# EAGLE schematic OpenSpindle (EAGLE 6.3)
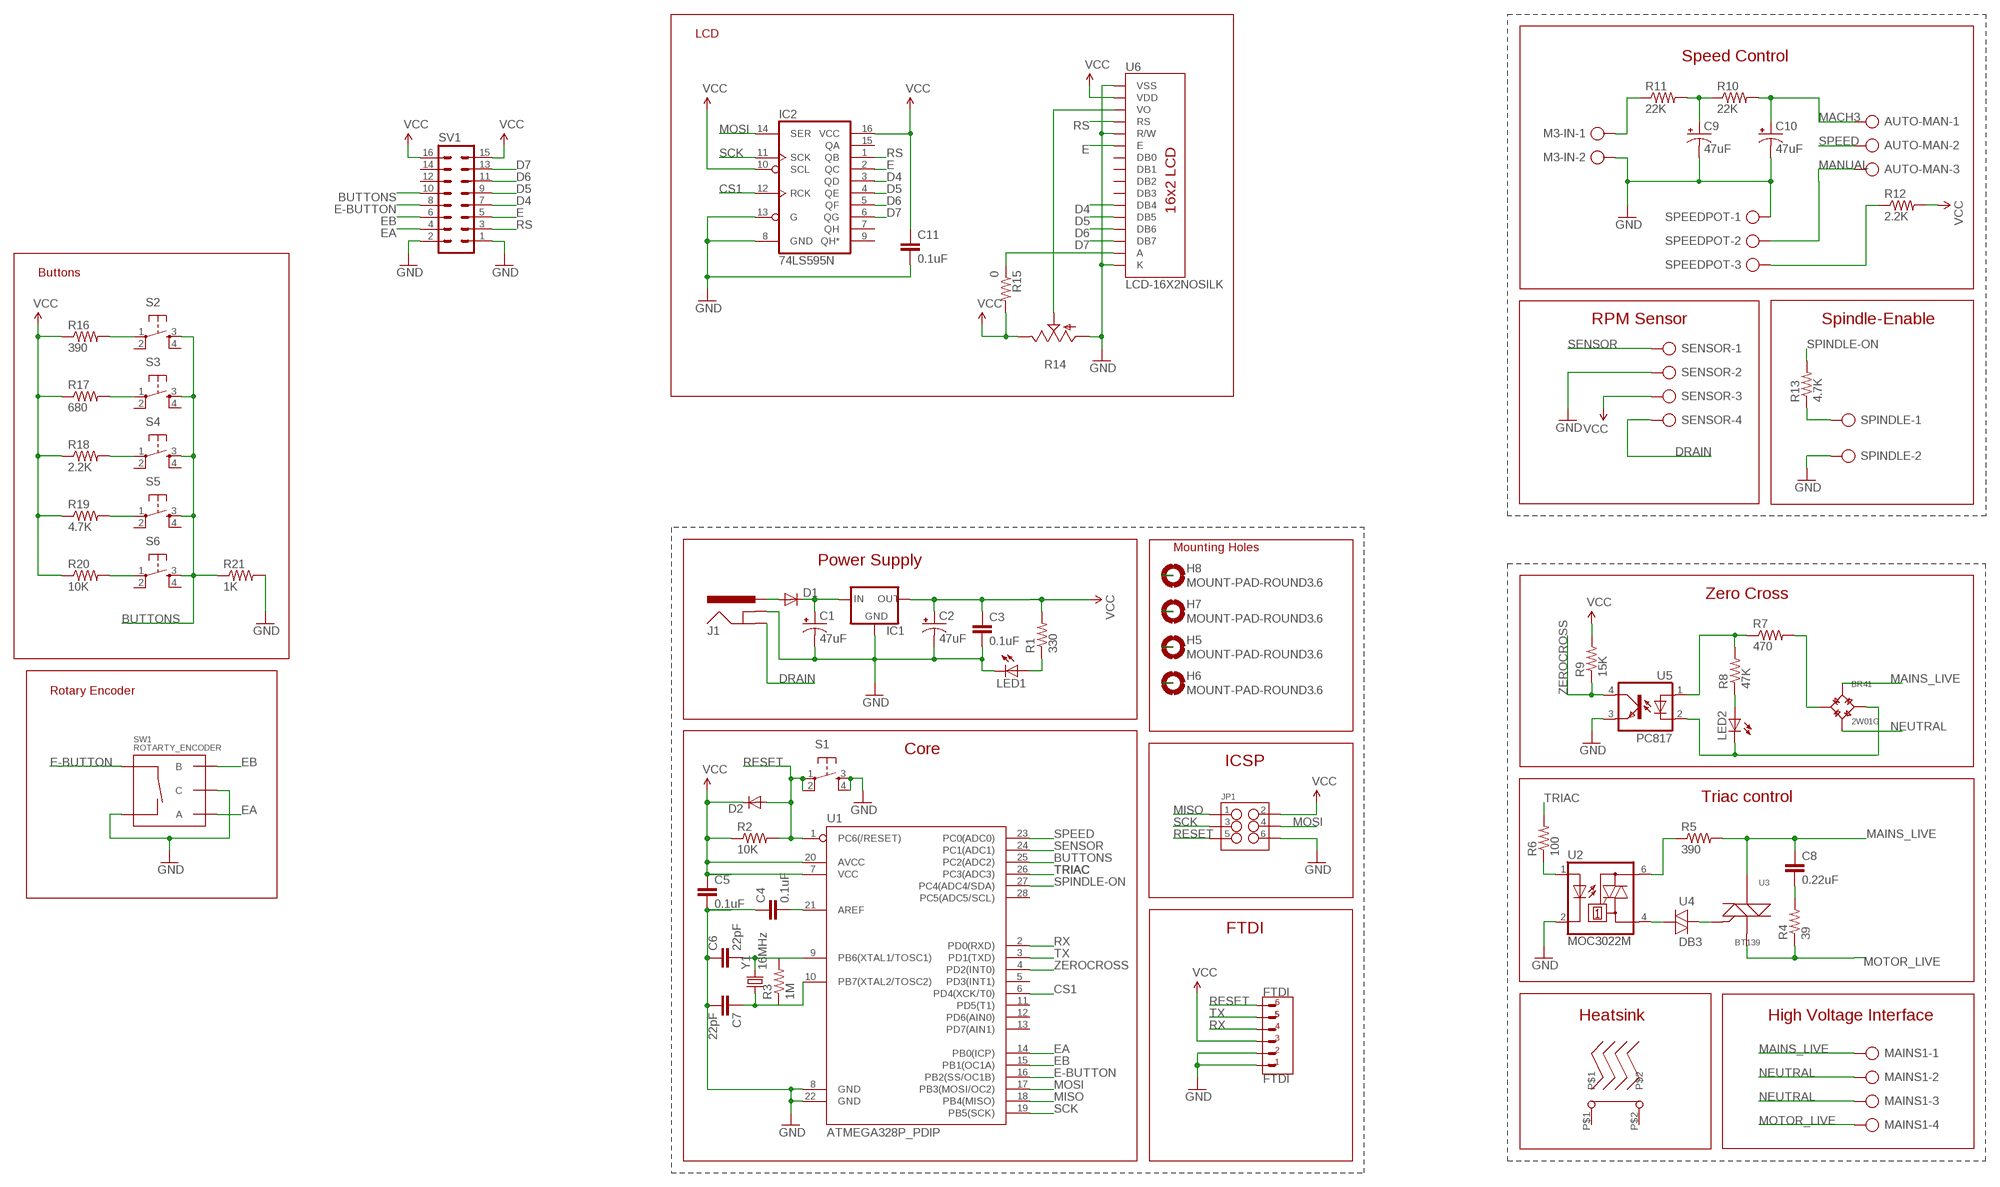
[diagram p0: schematic, sheet 1]

## Parts
AUTO-MAN  AK500/3  [AK500/3]
BR41  2W01G  DIODEBRIDGE  [DIODEBRIDGE]
C1  47uF  CAP_POLPTH2  [CPOL-RADIAL-10UF-25V]
C2  47uF  CAP_POLPTH2  [CPOL-RADIAL-10UF-25V]
C3  0.1uF  CAPPTH  [CAP-PTH-SMALL]
C4  0.1uF  CAPPTH  [CAP-PTH-SMALL]
C5  0.1uF  CAPPTH  [CAP-PTH-SMALL]
C6  22pF  CAPPTH  [CAP-PTH-SMALL]
C7  22pF  CAPPTH  [CAP-PTH-SMALL]
C8  0.22uF  CAPPTH  [CAP-PTH-SMALL]
C9  47uF  CAP_POLPTH2  [CPOL-RADIAL-10UF-25V]
C10  47uF  CAP_POLPTH2  [CPOL-RADIAL-10UF-25V]
C11  0.1uF  CAPPTH  [CAP-PTH-SMALL]
D1  DIODEPTH  [DIODE-1N4001]
D2  DIODEPTH  [DIODE-1N4001]
FTDI  FTDI  6PINHEADER0.1"  [6PINHEADER]
H5  MOUNT-PAD-ROUND3.6  [3,6-PAD]
H6  MOUNT-PAD-ROUND3.6  [3,6-PAD]
H7  MOUNT-PAD-ROUND3.6  [3,6-PAD]
H8  MOUNT-PAD-ROUND3.6  [3,6-PAD]
IC1  V_REG_78XX-TO-220  [TO-220-ALT]
IC2  74LS595N  [DIL16]
J1  POWER_JACKPTH_LOCK  [POWER_JACK_PTH_LOCK]
JP1  M03X2POGO_PINS  [2X3_POGO]
LED1  LED5MM  [LED5MM]
LED2  LED5MM  [LED5MM]
M3-IN  AK500/2  [AK500/2]
MAINS1  AK500/4  [AK500/4]
R1  330  RESISTORAXIAL-0.3  [AXIAL-0.3]
R2  10K  RESISTORAXIAL-0.3  [AXIAL-0.3]
R3  1M  RESISTORAXIAL-0.3  [AXIAL-0.3]
R4  39  RESISTORAXIAL-0.3  [AXIAL-0.3]
R5  390  RESISTORAXIAL-0.3  [AXIAL-0.3]
R6  100  RESISTORAXIAL-0.3  [AXIAL-0.3]
R7  470  RESISTORM_5-10  [SQM_5-10]
R8  47K  RESISTORM_5-10  [SQM_5-10]
R9  15K  RESISTORAXIAL-0.3  [AXIAL-0.3]
R10  22K  RESISTORAXIAL-0.3  [AXIAL-0.3]
R11  22K  RESISTORAXIAL-0.3  [AXIAL-0.3]
R12  2.2K  RESISTORAXIAL-0.3  [AXIAL-0.3]
R13  4.7K  RESISTORAXIAL-0.3  [AXIAL-0.3]
R14  POT_TRIM_US-B25U  [POT_B25U]
R15  0  RESISTORAXIAL-0.3  [AXIAL-0.3]
R16  390  RESISTORAXIAL-0.3  [AXIAL-0.3]
R17  680  RESISTORAXIAL-0.3  [AXIAL-0.3]
R18  2.2K  RESISTORAXIAL-0.3  [AXIAL-0.3]
R19  4.7K  RESISTORAXIAL-0.3  [AXIAL-0.3]
R20  10K  RESISTORAXIAL-0.3  [AXIAL-0.3]
R21  1K  RESISTORAXIAL-0.3  [AXIAL-0.3]
S1  TAC_SWITCHPTH  [TACTILE-PTH]
S2  TAC_SWITCHPTH  [TACTILE-PTH]
S3  TAC_SWITCHPTH  [TACTILE-PTH]
S4  TAC_SWITCHPTH  [TACTILE-PTH]
S5  TAC_SWITCHPTH  [TACTILE-PTH]
S6  TAC_SWITCHPTH  [TACTILE-PTH]
SENSOR  AK500/4  [AK500/4]
SPEEDPOT  AK500/3  [AK500/3]
SPINDLE  AK500/2  [AK500/2]
SV1  ML16  [ML16]
SW1  ROTARTY_ENCODER  [ROTARY_ENC_PLAIN]
U1  ATMEGA328P_PDIP  [DIL28-3]
U2  MOC3022M  [DIL06]
U3  BT139  TRIAC  [TRIAC]
U4  DB3  DIAC-DO35-10  [DO35-10]
U5  PC817  [DIL04]
U6  LCD-16X2NOSILK  [LCD-16X2_NOSILK]
U$2  HEATSINK529802B02500G  [529802B02500G]
Y1  16MHz  CRYSTALHC49UV  [HC49U-V]

## Nets
BUTTONS: R21.P$1 S2.3 S3.3 S4.3 S5.3 S6.3 SV1.10 U1.25(PC2(ADC2))
CS1: IC2.12(RCK) U1.6(PD4(XCK/T0))
D4: IC2.3(QD) SV1.7 U6.11(DB4)
D5: IC2.4(QE) SV1.9 U6.12(DB5)
D6: IC2.5(QF) SV1.11 U6.13(DB6)
D7: IC2.6(QG) SV1.13 U6.14(DB7)
DRAIN: J1.GND SENSOR.4
E: IC2.2(QC) SV1.5 U6.6(E)
E-BUTTON: SV1.8 SW1.SW+ U1.16(PB2(SS/OC1B))
EA: SV1.4 SW1.A U1.14(PB0(ICP))
EB: SV1.6 SW1.B U1.15(PB1(OC1A))
GND: C1.2(-) C2.2(-) C3.2 C4.1 C5.2 C6.1 C7.2 C9.2(-) C10.2(-) C11.2 FTDI.P$1 FTDI.P$2 IC1.GND IC2.8(GND) IC2.13(G) J1.GNDBREAK JP1.P$6 LED1.K(C) M3-IN.2 R14.A R21.P$2 S1.3 S1.4 SENSOR.2 SPEEDPOT.1 SPINDLE.2 SV1.1 SV1.2 SW1.C SW1.SW- U1.8(GND) U1.22(GND) U2.2(C) U5.3(EMIT) U6.1(VSS) U6.5(R/W) U6.16(K)
MACH3: AUTO-MAN.1 C10.1(+) R10.P$2
MACH3_PWM: M3-IN.1 R11.P$1
MAINS_LIVE: BR41.AC1 C8.1 MAINS1.1 R5.P$2 U3.2(A)
MANUAL: AUTO-MAN.3 SPEEDPOT.2
MISO: JP1.P$1 U1.18(PB4(MISO))
MOSI: IC2.14(SER) JP1.P$4 U1.17(PB3(MOSI/OC2))
MOTOR_LIVE: MAINS1.4 R4.P$1 U3.3(C)
N$1: U3.1(B) U4.C
N$2: C9.1(+) R10.P$1 R11.P$2
N$3: U2.4(A1) U4.A
N$4: LED1.A R1.P$1
N$5: C8.2 R4.P$2
N$6: R7.P1 R8.P2 U5.1(A)
N$7: BR41.- LED2.K(C) U5.2(C)
N$8: LED2.A R8.P1
N$9: H6.B3,6(MOUNT)
N$10: R12.P$1 SPEEDPOT.3
N$11: R20.P$2 S6.1
N$12: R13.P$1 SPINDLE.1
N$13: R6.P$1 U2.1(A)
N$14: R14.S U6.3(VO)
N$15: R5.P$1 U2.6(A2)
N$16: R19.P$2 S5.1
N$17: R15.P$1 U6.15(A)
N$18: H8.B3,6(MOUNT)
N$19: H7.B3,6(MOUNT)
N$20: C7.1 R3.P$1 U1.10(PB7(XTAL2/TOSC2)) Y1.1
N$21: H5.B3,6(MOUNT)
N$22: C6.2 R3.P$2 U1.9(PB6(XTAL1/TOSC1)) Y1.2
N$25: C1.1(+) D1.C IC1.IN
N$26: D1.A J1.PWR
N$28: C4.2 U1.21(AREF)
N$29: BR41.+ R7.P2
N$30: R18.P$2 S4.1
N$31: R17.P$2 S3.1
N$32: R16.P$2 S2.1
NEUTRAL: BR41.AC2 MAINS1.2 MAINS1.3
RESET: D2.A FTDI.P$6 JP1.P$5 R2.P$2 S1.1 S1.2 U1.1(PC6(/RESET))
RS: IC2.1(QB) SV1.3 U6.4(RS)
RX: FTDI.P$4 U1.2(PD0(RXD))
SCK: IC2.11(SCK) JP1.P$3 U1.19(PB5(SCK))
SENSOR: SENSOR.1 U1.24(PC1(ADC1))
SPEED: AUTO-MAN.2 U1.23(PC0(ADC0))
SPINDLE-ON: R13.P$2 U1.27(PC4(ADC4/SDA))
TRIAC: R6.P$2 U1.26(PC3(ADC3))
TX: FTDI.P$5 U1.3(PD1(TXD))
VCC: C2.1(+) C3.1 C5.1 C11.1 D2.C FTDI.P$3 IC1.OUT IC2.10(SCL) IC2.16(VCC) JP1.P$2 R1.P$2 R2.P$1 R9.P$2 R12.P$2 R14.E R15.P$2 R16.P$1 R17.P$1 R18.P$1 R19.P$1 R20.P$1 SENSOR.3 SV1.15 SV1.16 U1.7(VCC) U1.20(AVCC) U6.2(VDD)
ZEROCROSS: R9.P$1 U1.4(PD2(INT0)) U5.4(COL)
Unconnected: IC2.7(QH) IC2.9(QH*) IC2.15(QA) S2.2 S2.4 S3.2 S3.4 S4.2 S4.4 S5.2 S5.4 S6.2 S6.4 SV1.12 SV1.14 U1.5(PD3(INT1)) U1.11(PD5(T1)) U1.12(PD6(AIN0)) U1.13(PD7(AIN1)) U1.28(PC5(ADC5/SCL)) U6.7(DB0) U6.8(DB1) U6.9(DB2) U6.10(DB3) U$2.P$1 U$2.P$2

## Notes on the sheet
- LCD
- Speed Control
- Buttons
- RPM Sensor | Spindle-Enable
- Mounting Holes
- Power Supply
- Zero Cross
- Rotary Encoder
- Core
- ICSP
- Triac control
- FTDI
- Heatsink | High Voltage Interface

## Library data of the parts
AUTO-MAN SPEEDPOT = con-ptr500:AK500/3: CONNECTOR; OC_FARNELL: unknown; OC_NEWARK: unknown
BR41 = connectors:DIODEBRIDGE
C1 C2 C9 C10 = SparkFun:CAP_POL: Capacitor Polarized These are standard SMD and PTH capacitors. Normally 10uF, 47uF, and 100uF in electrolytic and tantalum varieties. Always verify the external diameter of the through hole cap, it varies with capacity, voltage, and manufacturer. The EIA devices should be standard.
C3-C7 C11 = SparkFun-Capacitors:CAP: Capacitor Standard 0603 ceramic capacitor, and 0.1" leaded capacitor.
C8 = SparkFun:CAP: Capacitor Standard 0603 ceramic capacitor, and 0.1" leaded capacitor.
D1 D2 = SparkFun-DiscreteSemi:DIODE: Diode These are standard reverse protection diodes and small signal diodes. SMA package can handle up to about 1A. SOD-323 can handle about 200mA. What the SOD-323 package when ordering, there are some mfgs out there that are 5-pin packages.
FTDI = connectors:6PINHEADER
H5-H8 = holes:MOUNT-PAD-ROUND: MOUNTING PAD, round
IC1 = SparkFun-PowerIC:V_REG_78XX: Voltage Regulator Standard 7805 5V regulator. IGO (Input Ground Output). Spark Fun Electronics SKU : COM-00107
IC2 = SparkFun-DigitalIC:74*595: 8-bit SHIFT REGISTER, output latch
J1 = SparkFun-Connectors:POWER_JACK: Power Jack This is the standard 5.5mm barrel jack for power. The PTH is the most common, proven, reliable, footprint. The Slot footprint only works if the mill layer is transmitted to the PCB fab house so be warned. Spark Fun Electronics SKU : PRT-00119 SMT: CONN-08106 Mating wall wart : TOL-00298 (and others)
JP1 = SparkFun-Connectors:M03X2: 2x3 .1" header. Shrouded, with keying- CONN-10681 SMT- CONN-11415 Pogo pins- HW-11044; PROD_ID: HW-11044
LED1 = adafruit2012:LED: LED OSRAM: - CHIPLED LG R971, LG N971, LY N971, LG Q971, LY Q971, LO R971, LY R971 LH N974, LH R974 LS Q976, LO Q976, LY Q976 LO Q996 - Hyper CHIPLED LW Q18S LB Q993, LB Q99A, LB R99A - SideLED LS A670, LO A670, LY A670, LG A670, LP A670 LB A673, LV A673, LT A673, LW A673 LH A674 LY A675 LS A676, LA A676, LO A676, LY A676, LW A676 LS A679, LY A679, LG A679 - Hyper Micro SIDELED® LS Y876, LA Y876, LO Y876, LY Y876 LT Y87S - SmartLED LW L88C, LW L88S LB L89C, LB L89S, LG L890 LS L89K, LO L89K, LY L89K LS L896, LA L896, LO L896, LY L896 - TOPLED LS T670, LO T670, LY T670, LG T670, LP T670 LSG T670, LSP T670, LSY T670, LOP T670, LYG T670 LG T671, LOG T671, LSG T671 LB T673, LV T673, LT T673, LW T673 LH T674 LS T676, LA T676, LO T676, LY T676, LB T676, LH T676, LSB T676, LW T676 LB T67C, LV T67C, LT T67C, LS T67K, LO T67K, LY T67K, LW E67C LS E67B, LA E67B, LO E67B, LY E67B, LB E67C, LV E67C, LT E67C LW T67C LS T679, LY T679, LG T679 LS T770, LO T770, LY T770, LG T770, LP T770 LB T773, LV T773, LT T773, LW T773 LH T774 LS E675, LA E675, LY E675, LS T675 LS T776, LA T776, LO T776, LY T776, LB T776 LHGB T686 LT T68C, LB T68C - Hyper Mini TOPLED® LB M676 - Mini TOPLED Santana® LG M470 LS M47K, LO M47K, LY M47K Source: http://www.osram.convergy.de/
LED2 = SparkFun-LED:LED: LEDs Standard schematic elements and footprints for 5mm, 3mm, 1206, and 0603 sized LEDs. 5mm - Spark Fun Electronics SKU : COM-00529 (and others)
M3-IN SPINDLE = con-ptr500:AK500/2: CONNECTOR; OC_FARNELL: unknown; OC_NEWARK: unknown
MAINS1 SENSOR = con-ptr500:AK500/4: CONNECTOR; OC_FARNELL: unknown; OC_NEWARK: unknown
R1-R13 R15-R21 = SparkFun-Resistors:RESISTOR: Resistor Basic schematic elements and footprints for 0603, 1206, and PTH resistors.
R14 = HeaterMeterPI:POT_TRIM_US-: POTENTIOMETER
S1-S6 = SparkFun-Electromechanical:TAC_SWITCH: Momentary Switch Button commonly used for reset or general input. Spark Fun Electronics SKU : COM-00097 SMT- SWCH-08247
SV1 = con-ml:ML16: HARTING; OC_FARNELL: unknown; OC_NEWARK: unknown
SW1 = SparkFun-Electromechanical:ROTARTY_ENCODER: Simple no LED rotary encoder Example: COM-09117
U1 = SparkFun-DigitalIC:ATMEGA328P_PDIP: uC used in the Arduino 32kb flash, 1k EEPROM, 2k SRAM This is the through-hole version of this chip.
U2 = optocoupler:MOC30*M: RANDOM-PHASE OPTOISOLATORS TRIAC DRIVER OUTPUT Source: http://www.fairchildsemi.com MOC3020-M.pdf; MF: FAIRCHILD SEMICONDUCTOR; MPN: MOC3022-M; OC_FARNELL: 1021086; OC_NEWARK: 58K1956
U3 = connectors:TRIAC
U4 = diode:DIAC-: DIAC
U5 = optocoupler:PC817: SHARP OPTO COUPLER; MPN: PC817X4J000F; OC_FARNELL: 9707727; OC_NEWARK: 97K7059
U6 = SparkFun-Displays:LCD-16X2: Standard text-only 16x2 parallel input LCD
U$2 = OSPID:HEATSINK
Y1 = SparkFun-FreqCtrl:CRYSTAL: Various standard crystals. Proven footprints. Spark Fun Electronics SKU : COM-00534

## Net classes
1 power: width 1.016 mm, clearance 0.305 mm